# Altium schematic sheet ESP.SchDoc
size A3
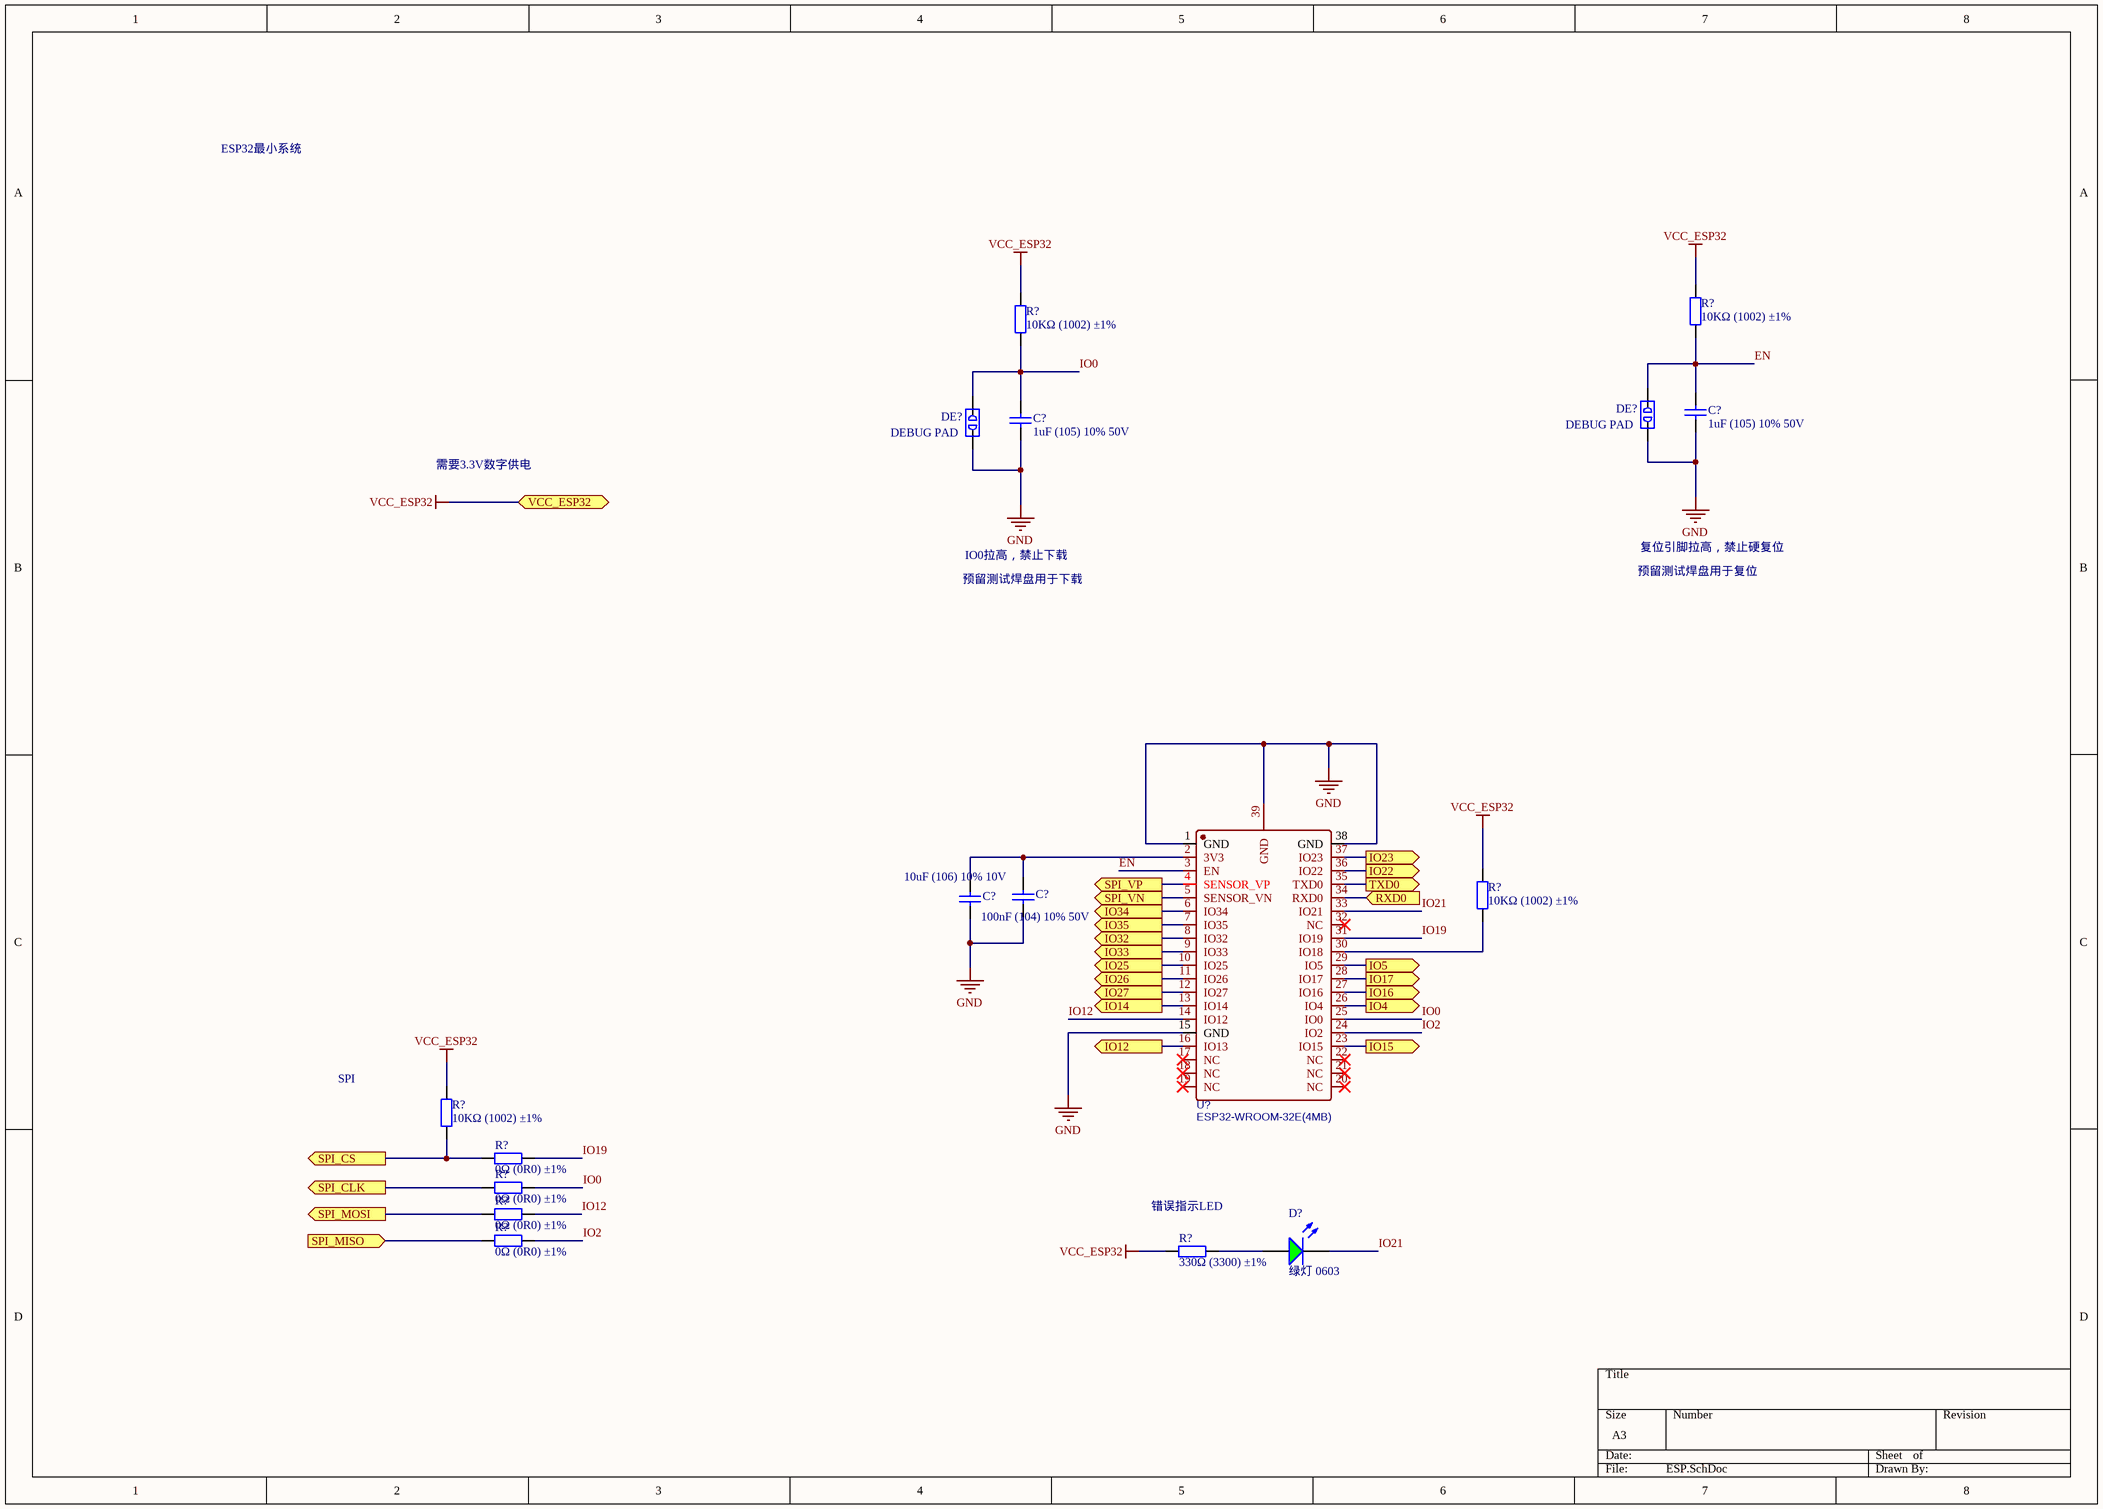
[diagram p0: ESP.SchDoc]

## Parts
(Parts that share a designator on the sheet are numbered #1, #2 ... from top to bottom, then left to right.)
C?#1  1uF (105) 10% 50V  [0603_C]
C?#2  1uF (105) 10% 50V  [0603_C]
C?#3  10uF (106) 10% 10V  [0603_C]
C?#4  100nF (104) 10% 50V  [0603_C]
D?  绿灯 0603  [0603_LED_S1]
DE?#1  DEBUG PAD  [DEBUG_A]
DE?#2  DEBUG PAD  [DEBUG_A]
R?#1  10KΩ (1002) ±1%  [0603_R]
R?#2  10KΩ (1002) ±1%  [0603_R]
R?#3  10KΩ (1002) ±1%  [0603_R]
R?#4  10KΩ (1002) ±1%  [0603_R]
R?#5  0Ω (0R0) ±1%  [0603_R]
R?#6  0Ω (0R0) ±1%  [0603_R]
R?#7  0Ω (0R0) ±1%  [0603_R]
R?#8  0Ω (0R0) ±1%  [0603_R]
R?#9  330Ω (3300) ±1%  [0603_R]
U?  ESP32-WROOM-32E(4MB)  [ESP32-WROOM-32E]

## Ports
IO4 (out), IO5 (out), IO12 (out), IO14 (out), IO15 (out), IO16 (out), IO17 (out), IO22 (out), IO23 (out), IO25 (out), IO26 (out), IO27 (out), IO32 (out), IO33 (out), IO34 (out), IO35 (out), RXD0 (in), SPI_CLK (out), SPI_CS (out), SPI_MISO (in), SPI_MOSI (out), SPI_VN (out), SPI_VP (out), TXD0 (out), VCC_ESP32 (bidir)

## Nets
GND: C?#1.1 C?#2.1 C?#3.1 C?#4.1 DE?#1.1 DE?#2.1 U?.1(GND) U?.15(GND) U?.38(GND) U?.39(GND)
VCC_ESP32: R?#1.2 R?#2.2 R?#3.2 R?#4.2 R?#9.1 ; port VCC_ESP32
EN: C?#1.2 DE?#1.2 R?#1.1 U?.3(EN)
IO0: C?#2.2 DE?#2.2 R?#2.1 R?#6.1 U?.25(IO0)
IO2: R?#8.1 U?.24(IO2)
IO4: U?.26(IO4) ; port IO4
IO5: U?.29(IO5) ; port IO5
IO12: R?#7.1 U?.14(IO12)
IO12: U?.16(IO13) ; port IO12  [a separate net that carries the same name]
IO14: U?.13(IO14) ; port IO14
IO15: U?.23(IO15) ; port IO15
IO16: U?.27(IO16) ; port IO16
IO17: U?.28(IO17) ; port IO17
IO19: R?#5.1 U?.31(IO19)
IO21: D?.K U?.33(IO21)
IO22: U?.36(IO22) ; port IO22
IO23: U?.37(IO23) ; port IO23
IO25: U?.10(IO25) ; port IO25
IO26: U?.11(IO26) ; port IO26
IO27: U?.12(IO27) ; port IO27
IO32: U?.8(IO32) ; port IO32
IO33: U?.9(IO33) ; port IO33
IO34: U?.6(IO34) ; port IO34
IO35: U?.7(IO35) ; port IO35
RXD0: U?.34(RXD0) ; port RXD0
SPI_CLK: R?#6.2 ; port SPI_CLK
SPI_CS: R?#4.1 R?#5.2 ; port SPI_CS
SPI_MISO: R?#8.2 ; port SPI_MISO
SPI_MOSI: R?#7.2 ; port SPI_MOSI
SPI_VN: U?.5(SENSOR_VN) ; port SPI_VN
SPI_VP: U?.4(SENSOR_VP) ; port SPI_VP
TXD0: U?.35(TXD0) ; port TXD0
NetC?#3_2: C?#3.2 C?#4.2 U?.2(3V3)
NetD?_A: D?.A R?#9.2
NetR?#3_1: R?#3.1 U?.30(IO18)

Not connected (* = marked no-connect by the designer): U? 17(NC)* 18(NC)* 19(NC)* 20(NC)* 21(NC)* 22(NC)* 32(NC)*

## Notes on the sheet
- ESP32最小系统
- 需要3.3V数字供电
- 预留测试焊盘用于下载
- IO0拉高，禁止下载
- 预留测试焊盘用于复位
- 复位引脚拉高，禁止硬复位
- SPI
- (near R?#9) 错误指示LED

## Library data of the parts
C?#1 C?#2 = 0603 1uF (105) 10% 50V: 贴片电容; ComponentLink1Description: 供应商链接; ComponentLink1URL: http://www.szlcsc.com/product/details_16531.html; Package: 0603; Supplier: LC; SuppliersPartNumber: C15849
C?#3 = 0603 10uF (106) 10% 10V: 贴片电容; ComponentLink1Description: 供应商链接; ComponentLink1URL: http://www.szlcsc.com/product/details_20411.html; Package: 0603; Supplier: LC; SuppliersPartNumber: C19702
C?#4 = 0603 100nF (104) 10% 50V: 贴片电容; ComponentLink1Description: 供应商链接; ComponentLink1URL: http://www.szlcsc.com/product/details_15331.html; Package: 0603; Supplier: LC; SuppliersPartNumber: C14663
D? = 0603 绿灯: 发光二极管; ComponentLink1Description: 供应商链接; ComponentLink1URL: http://www.szlcsc.com/product/details_73152.html; Package: 0603; Supplier: LC; SuppliersPartNumber: C72043
DE?#1 DE?#2 = DEBUG: 调试断点焊盘; 版权归属: 源创客; BOM名称: 调试断点焊盘; 学习资源: www.ooocke.com
R?#1-R?#4 = 0603 10KΩ (1002) 1%: 贴片电阻; ComponentLink1Description: 供应商链接; ComponentLink1URL: http://www.szlcsc.com/product/details_26547.html; Package: 0603; Supplier: LC; SuppliersPartNumber: C25804
R?#5-R?#8 = 0603 0Ω (0R0) 1%: 贴片电阻; ComponentLink1Description: 供应商链接; ComponentLink1URL: http://www.szlcsc.com/product/details_21903.html; Package: 0603; Supplier: LC; SuppliersPartNumber: C21189
R?#9 = 0603 330Ω (3300) 1%: 贴片电阻; ComponentLink1Description: 供应商链接; ComponentLink1URL: http://www.szlcsc.com/product/details_23865.html; Package: 0603; Supplier: LC; SuppliersPartNumber: C23138
U? = ESP32-WROOM-32E(4MB): BOM_Manufacturer: Espressif Systems; Contributor: LCSC; BOM_Paste Type: expand; BOM_Supplier: LCSC; BOM_Supplier Part: C701341; BOM_Manufacturer Part: ESP32-WROOM-32E(4MB); spicePre: U; spiceSymbolName: ESP32-WROOM-32E(4MB)